# Altium schematic sheet RPL_MCU.SchDoc: MCU
size A; Date: Dec 27, 2017; DrawnBy: Seyed Omid Hasanli; Revision: 3.0; SheetNumber: 6
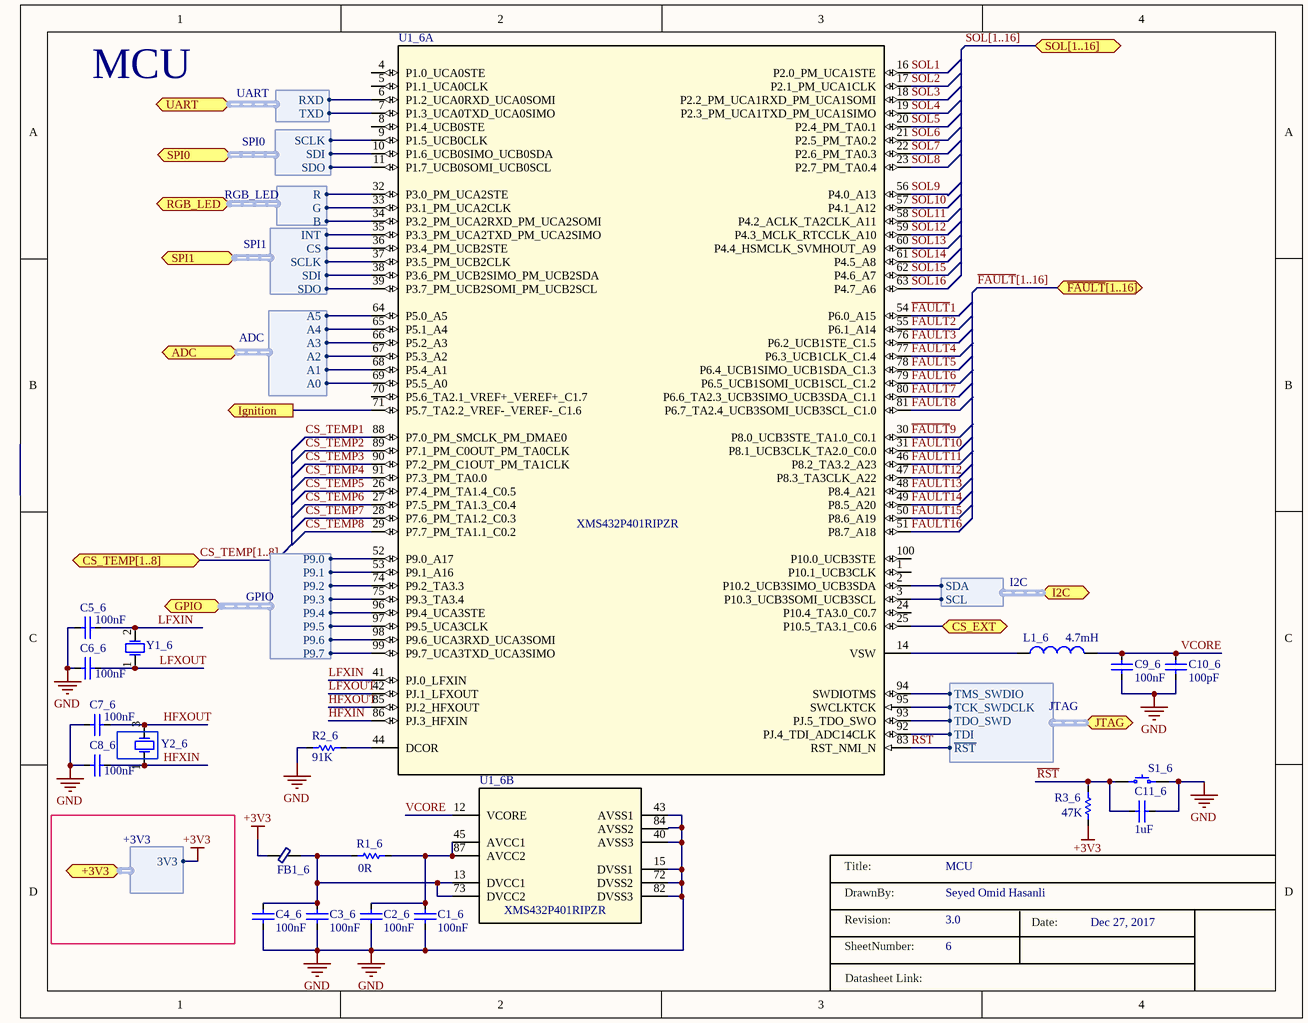
[diagram p0: RPL_MCU.SchDoc]

## Parts
C1_6  value 100nF  [C0805C475K9RACAUTO]  (hidden comment: Cap)
C2_6  value 100nF  [C0805C475K9RACAUTO]  (hidden comment: Cap)
C3_6  value 100nF  [C0805C475K9RACAUTO]  (hidden comment: Cap)
C4_6  value 100nF  [C0805C475K9RACAUTO]  (hidden comment: Cap)
C5_6  value 100nF  [C0805C475K9RACAUTO]  (hidden comment: Cap)
C6_6  value 100nF  [C0805C475K9RACAUTO]  (hidden comment: Cap)
C7_6  value 100nF  [C0805C475K9RACAUTO]  (hidden comment: Cap)
C8_6  value 100nF  [C0805C475K9RACAUTO]  (hidden comment: Cap)
C9_6  value 100nF  [C0805C475K9RACAUTO]  (hidden comment: Cap)
C10_6  value 100pF  [C0805C475K9RACAUTO]  (hidden comment: Cap)
C11_6  value 1uF  [C0805C475K9RACAUTO]  (hidden comment: Cap)
FB1_6  ferrite bead  [RES 0805]  (value not drawn)
L1_6  value 4.7mH  [INDC2016X95]  (hidden comment: Inductor)
R1_6  value 0R  [RES 0805]  (hidden comment: Res)
R2_6  value 91K  [RES 0805]  (hidden comment: Res)
R3_6  value 47K  [RES 0805]  (hidden comment: Res)
S1_6  FSMSMTR  [TE FSMSMTR]  (value not drawn)
U1_6  XMS432P401RIPZR  [PZ0100A_N]  (parts A,B of 2)
Y1_6  32.7680KHZ 12.5PF  [XTAL320X150X90]  (value not drawn)
Y2_6  48.00 MHZ 12.0PF  [OSCSC105P160X120X35-4N]  (value not drawn)

## Ports
+3V3 (harness +3V3), ADC (harness ADC), CS_EXT (bidir), CS_TEMP[1..8], GPIO (harness GPIO), I2C (harness I2C), Ignition (out), JTAG (harness JTAG), RGB_LED (harness RGB_LED), SOL[1..16], SPI0 (harness SPI0), SPI1 (harness SPI1), UART (harness UART), ~{FAULT}[1..16]

## Harnesses
I2C: SDA, SCL
UART: RXD, TXD
SPI0: SCLK, SDI, SDO
SPI1: SCLK, SDI, SDO, INT, CS
JTAG: TMS_SWDIO, TCK_SWDCLK, TDO_SWD, TDI, ~{RST}
ADC: A5, A4, A3, A2, A1, A0
RGB_LED: R, G, B
+3V3: 3V3
GPIO: P9.0, P9.1, P9.2, P9.3, P9.4, P9.5, P9.6, P9.7

## Nets
+3V3: FB1_6.1 R3_6.1 ; port +3V3.3V3
GND: C1_6.1 C2_6.1 C3_6.1 C4_6.1 C5_6.1 C6_6.1 C7_6.1 C8_6.1 C9_6.1 C10_6.1 C11_6.2 R2_6.1 S1_6.2 U1_6.15(DVSS1) U1_6.40(AVSS3) U1_6.43(AVSS1) U1_6.72(DVSS2) U1_6.82(DVSS3)
CS_EXT: U1_6.25(P10.5_TA3.1_C0.6) ; port CS_EXT
CS_TEMP1: U1_6.88(P7.0_PM_SMCLK_PM_DMAE0)
CS_TEMP2: U1_6.89(P7.1_PM_C0OUT_PM_TA0CLK)
CS_TEMP3: U1_6.90(P7.2_PM_C1OUT_PM_TA1CLK)
CS_TEMP4: U1_6.91(P7.3_PM_TA0.0)
CS_TEMP5: U1_6.26(P7.4_PM_TA1.4_C0.5)
CS_TEMP6: U1_6.27(P7.5_PM_TA1.3_C0.4)
CS_TEMP7: U1_6.28(P7.6_PM_TA1.2_C0.3)
CS_TEMP8: U1_6.29(P7.7_PM_TA1.1_C0.2)
~{FAULT}1: U1_6.54(P6.0_A15)
~{FAULT}2: U1_6.55(P6.1_A14)
~{FAULT}3: U1_6.76(P6.2_UCB1STE_C1.5)
~{FAULT}4: U1_6.77(P6.3_UCB1CLK_C1.4)
~{FAULT}5: U1_6.78(P6.4_UCB1SIMO_UCB1SDA_C1.3)
~{FAULT}6: U1_6.79(P6.5_UCB1SOMI_UCB1SCL_C1.2)
~{FAULT}7: U1_6.80(P6.6_TA2.3_UCB3SIMO_UCB3SDA_C1.1)
~{FAULT}8: U1_6.81(P6.7_TA2.4_UCB3SOMI_UCB3SCL_C1.0)
~{FAULT}9: U1_6.30(P8.0_UCB3STE_TA1.0_C0.1)
~{FAULT}10: U1_6.31(P8.1_UCB3CLK_TA2.0_C0.0)
~{FAULT}11: U1_6.46(P8.2_TA3.2_A23)
~{FAULT}12: U1_6.47(P8.3_TA3CLK_A22)
~{FAULT}13: U1_6.48(P8.4_A21)
~{FAULT}14: U1_6.49(P8.5_A20)
~{FAULT}15: U1_6.50(P8.6_A19)
~{FAULT}16: U1_6.51(P8.7_A18)
HFXIN: C8_6.2 U1_6.86(PJ.3_HFXIN) Y2_6.1(OSC1)
HFXOUT: C7_6.2 U1_6.85(PJ.2_HFXOUT) Y2_6.3(OSC3)
Ignition: U1_6.71(P5.7_TA2.2_VREF-_VEREF-_C1.6) ; port Ignition
LFXIN: C5_6.2 U1_6.41(PJ.0_LFXIN) Y1_6.2(OSC2)
LFXOUT: C6_6.2 U1_6.42(PJ.1_LFXOUT) Y1_6.1(OSC1)
~{RST}: C11_6.1 R3_6.2 S1_6.1 U1_6.83(RST_NMI_N) ; port JTAG.~{RST}
SOL1: U1_6.16(P2.0_PM_UCA1STE)
SOL2: U1_6.17(P2.1_PM_UCA1CLK)
SOL3: U1_6.18(P2.2_PM_UCA1RXD_PM_UCA1SOMI)
SOL4: U1_6.19(P2.3_PM_UCA1TXD_PM_UCA1SIMO)
SOL5: U1_6.20(P2.4_PM_TA0.1)
SOL6: U1_6.21(P2.5_PM_TA0.2)
SOL7: U1_6.22(P2.6_PM_TA0.3)
SOL8: U1_6.23(P2.7_PM_TA0.4)
SOL9: U1_6.56(P4.0_A13)
SOL10: U1_6.57(P4.1_A12)
SOL11: U1_6.58(P4.2_ACLK_TA2CLK_A11)
SOL12: U1_6.59(P4.3_MCLK_RTCCLK_A10)
SOL13: U1_6.60(P4.4_HSMCLK_SVMHOUT_A9)
SOL14: U1_6.61(P4.5_A8)
SOL15: U1_6.62(P4.6_A7)
SOL16: U1_6.63(P4.7_A6)
VCORE: C9_6.2 C10_6.2 L1_6.2 U1_6.12(VCORE)
NetC1_6_2: C1_6.2 C2_6.2 R1_6.2 U1_6.45(AVCC1) U1_6.87(AVCC2)
NetC3_6_2: C3_6.2 C4_6.2 FB1_6.2 R1_6.1 U1_6.13(DVCC1) U1_6.73(DVCC2)
NetL1_6_1: L1_6.1 U1_6.14(VSW)
NetR2_6_2: R2_6.2 U1_6.44(DCOR)
NetU1_6_2: U1_6.2(P10.2_UCB3SIMO_UCB3SDA) ; port I2C.SDA
NetU1_6_3: U1_6.3(P10.3_UCB3SOMI_UCB3SCL) ; port I2C.SCL
NetU1_6_6: U1_6.6(P1.2_UCA0RXD_UCA0SOMI) ; port UART.RXD
NetU1_6_7: U1_6.7(P1.3_UCA0TXD_UCA0SIMO) ; port UART.TXD
NetU1_6_9: U1_6.9(P1.5_UCB0CLK) ; port SPI0.SCLK
NetU1_6_10: U1_6.10(P1.6_UCB0SIMO_UCB0SDA) ; port SPI0.SDI
NetU1_6_11: U1_6.11(P1.7_UCB0SOMI_UCB0SCL) ; port SPI0.SDO
NetU1_6_32: U1_6.32(P3.0_PM_UCA2STE) ; port RGB_LED.R
NetU1_6_33: U1_6.33(P3.1_PM_UCA2CLK) ; port RGB_LED.G
NetU1_6_34: U1_6.34(P3.2_PM_UCA2RXD_PM_UCA2SOMI) ; port RGB_LED.B
NetU1_6_35: U1_6.35(P3.3_PM_UCA2TXD_PM_UCA2SIMO) ; port SPI1.INT
NetU1_6_36: U1_6.36(P3.4_PM_UCB2STE) ; port SPI1.CS
NetU1_6_37: U1_6.37(P3.5_PM_UCB2CLK) ; port SPI1.SCLK
NetU1_6_38: U1_6.38(P3.6_PM_UCB2SIMO_PM_UCB2SDA) ; port SPI1.SDI
NetU1_6_39: U1_6.39(P3.7_PM_UCB2SOMI_PM_UCB2SCL) ; port SPI1.SDO
NetU1_6_52: U1_6.52(P9.0_A17) ; port GPIO.P9.0
NetU1_6_53: U1_6.53(P9.1_A16) ; port GPIO.P9.1
NetU1_6_64: U1_6.64(P5.0_A5) ; port ADC.A5
NetU1_6_65: U1_6.65(P5.1_A4) ; port ADC.A4
NetU1_6_66: U1_6.66(P5.2_A3) ; port ADC.A3
NetU1_6_67: U1_6.67(P5.3_A2) ; port ADC.A2
NetU1_6_68: U1_6.68(P5.4_A1) ; port ADC.A1
NetU1_6_69: U1_6.69(P5.5_A0) ; port ADC.A0
NetU1_6_74: U1_6.74(P9.2_TA3.3) ; port GPIO.P9.2
NetU1_6_75: U1_6.75(P9.3_TA3.4) ; port GPIO.P9.3
NetU1_6_92: U1_6.92(PJ.4_TDI_ADC14CLK) ; port JTAG.TDI
NetU1_6_93: U1_6.93(PJ.5_TDO_SWO) ; port JTAG.TDO_SWD
NetU1_6_94: U1_6.94(SWDIOTMS) ; port JTAG.TMS_SWDIO
NetU1_6_95: U1_6.95(SWCLKTCK) ; port JTAG.TCK_SWDCLK
NetU1_6_96: U1_6.96(P9.4_UCA3STE) ; port GPIO.P9.4
NetU1_6_97: U1_6.97(P9.5_UCA3CLK) ; port GPIO.P9.5
NetU1_6_98: U1_6.98(P9.6_UCA3RXD_UCA3SOMI) ; port GPIO.P9.6
NetU1_6_99: U1_6.99(P9.7_UCA3TXD_UCA3SIMO) ; port GPIO.P9.7

Not connected (* = marked no-connect by the designer): U1_6 1(P10.1_UCB3CLK) 4(P1.0_UCA0STE) 5(P1.1_UCA0CLK) 8(P1.4_UCB0STE) 24(P10.4_TA3.0_C0.7) 70(P5.6_TA2.1_VREF+_VEREF+_C1.7) 84(AVSS2) 100(P10.0_UCB3STE); Y2_6 2(OSC2) 4(OSC4)

## Buses and harness runs
bus CS_TEMP[1..8] = port CS_TEMP[1..8]
bus SOL[1..16] = port SOL[1..16]
bus ~{FAULT}[1..16] = port ~{FAULT}[1..16]

## Notes on the sheet
- MCU
- Title:
- DrawnBy:
- Revision:
- SheetNumber:
- Date:
- Datasheet Link:

## Library data of the parts
S1_6 = FSMSMTR: SWITCH TACTILE SPST-NO 0.05A 24V; Manufacturer: TE Connectivity Alcoswitch Switches; Switch Function: Off-Mom; Contact Rating @ Voltage: 0.05A @ 24VDC; Actuator Type: Standard; Actuator Orientation: Top Actuated; Illumination: Non-Illuminated; Operating Force: 180gf; Switch Travel: 0.25mm; Mechanical Life: 20,000 Cycles; Part Number: FSMSMTR; PartId: 8251; Supplier 1: Digi-Key; Supplier Part Number 1: 450-1758-2-ND; ComponentLink1Description: Datasheet; ComponentLink1URL: http://www.te.com/commerce/DocumentDelivery/DDEController?Action=srchrtrv&DocNm=1437566-3&DocType=Customer+Drawing&DocLang=English; ComponentLink2Description: Digi-Key Listing; ComponentLink2URL: http://www.digikey.com/product-detail/en/FSMSMTR/450-1758-2-ND/529671; Price: 0.175; Circuit: SPST-NO; Illumination Voltage: -; Illumination Type, Colour: -; Operating Temperature: -35C ~ 85C
U1_6 = XMS432P401RIPZR: Imported; Manufacturer: Texas Instruments; CompType: IC; PIN_COUNT: 100; PartNumber: XMS432P401RIPZR; PackageReference: PZ0100A; MountType: SMT; RefDes: RefDes; TYPE: TYPE; Value: Value
Y1_6 = XTAL
Y2_6 = XTAL_4pin_16MHz_8pF